# Altium project Steering 2020.PrjPcb
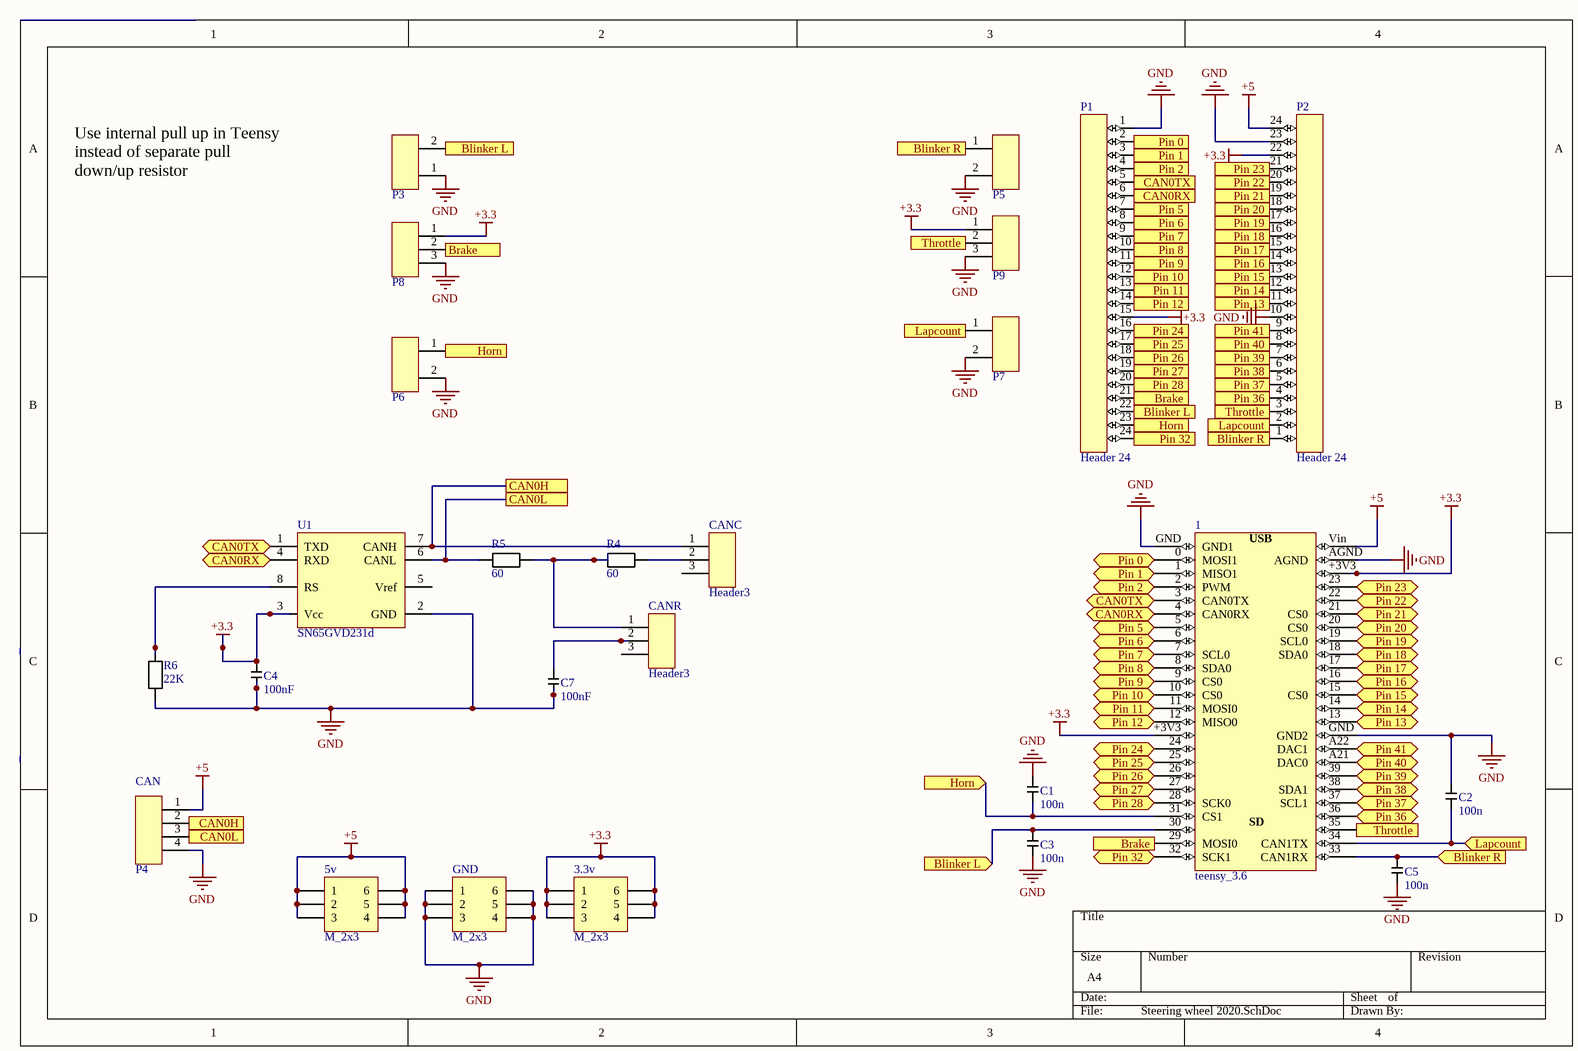
[diagram p0: Steering wheel 2020.SchDoc]
1 sheet, 25 parts. Net scope: flat (ports and power ports of the same name join across sheets).
Board file: Steering wheel 2020.PcbDoc

## Sheet Steering wheel 2020.SchDoc
size A4

### Parts
1  teensy_3.6  [teensy_3.6]
3.3v  M_2x3  [PIN_HEADER_M_2x3]
5v  M_2x3  [PIN_HEADER_M_2x3]
C1  value 100n  [C_SMD_0805_pcb]  (hidden comment: SMD)
C2  value 100n  [C_SMD_0805_pcb]  (hidden comment: SMD)
C3  value 100n  [C_SMD_0805_pcb]  (hidden comment: SMD)
C4  value 100nF  [C_SMD_0805_pcb]  (hidden comment: SMD)
C5  value 100n  [C_SMD_0805_pcb]  (hidden comment: SMD)
C7  value 100nF  [C_SMD_0805_pcb]  (hidden comment: SMD)
CANC  Header3  [PIN_HEADER_M_1x3]
CANR  Header3  [PIN_HEADER_M_1x3]
GND  M_2x3  [PIN_HEADER_M_2x3]
P1  Header 24  [PIN_HEADER_M_1x24]
P2  Header 24  [PIN_HEADER_M_1x24]
P3  JST_SE_2PIN  [JST_SE_2PIN]  (value not drawn)
P4  JST_SE_4PIN  [JST_SE_4PIN]  (value not drawn)
P5  JST_SE_2PIN  [JST_SE_2PIN]  (value not drawn)
P6  JST_SE_2PIN  [JST_SE_2PIN]  (value not drawn)
P7  JST_SE_2PIN  [JST_SE_2PIN]  (value not drawn)
P8  JST_SE_3PIN  [JST_SE_3PIN]  (value not drawn)
P9  JST_SE_3PIN  [JST_SE_3PIN]  (value not drawn)
R4  value 60  [R_SMD_0805_pcb]  (hidden comment: SMD)
R5  value 60  [R_SMD_0805_pcb]  (hidden comment: SMD)
R6  value 22K  [R_SMD_0805_pcb]  (hidden comment: SMD)
U1  SN65GVD231d  [SN65HVD231D_SMD]

### Ports
Blinker L, Blinker L (in), Blinker R, Blinker R (in), Brake, Brake (in), CAN0H, CAN0L, CAN0RX, CAN0RX (bidir), CAN0TX, CAN0TX (bidir), Horn, Horn (in), Lapcount, Lapcount (in), Pin 0, Pin 0 (bidir), Pin 1, Pin 1 (bidir), Pin 2, Pin 2 (bidir), Pin 5, Pin 5 (bidir), Pin 6, Pin 6 (bidir), Pin 7, Pin 7 (bidir), Pin 8, Pin 8 (bidir), Pin 9, Pin 9 (bidir), Pin 10, Pin 10 (bidir), Pin 11, Pin 11 (bidir), Pin 12, Pin 12 (bidir), Pin 13, Pin 13 (bidir), Pin 14, Pin 14 (bidir), Pin 15, Pin 15 (bidir), Pin 16, Pin 16 (bidir), Pin 17, Pin 17 (bidir), Pin 18, Pin 18 (bidir), Pin 19, Pin 19 (bidir), Pin 20, Pin 20 (bidir), Pin 21, Pin 21 (bidir), Pin 22, Pin 22 (bidir), Pin 23, Pin 23 (bidir), Pin 24, Pin 24 (bidir), Pin 25, Pin 25 (bidir), Pin 26, Pin 26 (bidir), Pin 27, Pin 27 (bidir), Pin 28, Pin 28 (bidir), Pin 32, Pin 32 (bidir), Pin 36, Pin 36 (bidir), Pin 37, Pin 37 (bidir), Pin 38, Pin 38 (bidir), Pin 39, Pin 39 (bidir), Pin 40, Pin 40 (bidir), Pin 41, Pin 41 (bidir), Throttle, Throttle (in)

### Nets
+3.3: 1.+3V3 3.3v.1 3.3v.2 3.3v.3 3.3v.4 3.3v.5 3.3v.6 C4.1 P1.15 P2.22 P8.1 P9.1 U1.3(Vcc)
+5: 1.Vin 5v.1 5v.2 5v.3 5v.4 5v.5 5v.6 P2.24 P4.1
GND: 1.AGND 1.GND(GND1) C1.1 C2.1 C3.2 C4.2 C5.2 C7.2 GND.1 GND.2 GND.3 GND.4 GND.5 GND.6 P1.1 P2.10 P2.23 P3.1 P4.4 P5.2 P6.2 P7.2 P8.3 P9.3 R6.1 U1.2(GND)
Net1_0: 1.0(MOSI1) P1.2 ; port Pin 0
Net1_1: 1.1(MISO1) P1.3 ; port Pin 1
Net1_2: 1.2(PWM) P1.4 ; port Pin 2
Net1_3: 1.3(CAN0TX) P1.5 U1.1(TXD) ; port CAN0TX
Net1_4: 1.4(CAN0RX) P1.6 U1.4(RXD) ; port CAN0RX
Net1_5: 1.5 P1.7 ; port Pin 5
Net1_6: 1.6 P1.8 ; port Pin 6
Net1_7: 1.7(SCL0) P1.9 ; port Pin 7
Net1_8: 1.8(SDA0) P1.10 ; port Pin 8
Net1_9: 1.9(CS0) P1.11 ; port Pin 9
Net1_10: 1.10(CS0) P1.12 ; port Pin 10
Net1_11: 1.11(MOSI0) P1.13 ; port Pin 11
Net1_12: 1.12(MISO0) P1.14 ; port Pin 12
Net1_13: 1.13 P2.11 ; port Pin 13
Net1_14: 1.14 P2.12 ; port Pin 14
Net1_15: 1.15(CS0) P2.13 ; port Pin 15
Net1_16: 1.16 P2.14 ; port Pin 16
Net1_17: 1.17 P2.15 ; port Pin 17
Net1_18: 1.18(SDA0) P2.16 ; port Pin 18
Net1_19: 1.19(SCL0) P2.17 ; port Pin 19
Net1_20: 1.20(CS0) P2.18 ; port Pin 20
Net1_21: 1.21(CS0) P2.19 ; port Pin 21
Net1_22: 1.22 P2.20 ; port Pin 22
Net1_23: 1.23 P2.21 ; port Pin 23
Net1_24: 1.24 P1.16 ; port Pin 24
Net1_25: 1.25 P1.17 ; port Pin 25
Net1_26: 1.26 P1.18 ; port Pin 26
Net1_27: 1.27 P1.19 ; port Pin 27
Net1_28: 1.28(SCK0) P1.20 ; port Pin 28
Net1_29: 1.29(MOSI0) P1.21 P8.2 ; port Brake
Net1_30: 1.30 C3.1 P1.22 P3.2 ; port Blinker L
Net1_31: 1.31(CS1) C1.2 P1.23 P6.1 ; port Horn
Net1_32: 1.32(SCK1) P1.24 ; port Pin 32
Net1_33: 1.33(CAN1RX) C5.1 P2.1 P5.1 ; port Blinker R
Net1_34: 1.34(CAN1TX) C2.2 P2.2 P7.1 ; port Lapcount
Net1_35: 1.35 P2.3 P9.2 ; port Throttle
Net1_36: 1.36 P2.4 ; port Pin 36
Net1_37: 1.37(SCL1) P2.5 ; port Pin 37
Net1_38: 1.38(SDA1) P2.6 ; port Pin 38
Net1_39: 1.39 P2.7 ; port Pin 39
Net1_A21: 1.A21(DAC0) P2.8 ; port Pin 40
Net1_A22: 1.A22(DAC1) P2.9 ; port Pin 41
NetC7_1: C7.1 CANR.2
NetCANC_1: CANC.1 P4.2 U1.7(CANH) ; port CAN0H
NetCANC_2: CANC.2 R4.2
NetCANR_1: CANR.1 R4.1 R5.2
NetP4_3: P4.3 R5.1 U1.6(CANL) ; port CAN0L
NetR6_2: R6.2 U1.8(RS)

Not connected (* = marked no-connect by the designer): CANC 3; CANR 3; U1 5(Vref)

### Notes on the sheet
- Use internal pull up in Teensy instead of separate pull down/up resistor
- (near P4) CAN
- (in symbol teensy_3.6) USB; SD

### Library data of the parts
3.3v 5v GND = PIN_HEADER_M_2x3: Supplier 1: *; Supplier Part Number 1: *
C1-C5 C7 = C_SMD_0805: Supplier 1: *; Supplier Part Number 1: *
CANC CANR = PIN_HEADER_M_1x3
P1 P2 = PIN_HEADER_M_1x24: Supplier Part Number 1: *; Supplier 1: *
R4-R6 = R_SMD_0805: Supplier 1: *; Supplier Part Number 1: *
U1 = SN65HVD231D_SMD: Supplier 1: *; Supplier Part Number 1: *
P3 P5-P7 = JST_SE_2PIN: Supplier 1: *; Supplier Part Number 1: *
P4 = JST_SE_4PIN: Supplier Link 1: *; Supplier Part Number 1: *
P8 P9 = JST_SE_3PIN: Supplier Part Number 1: *; Supplier 1: *